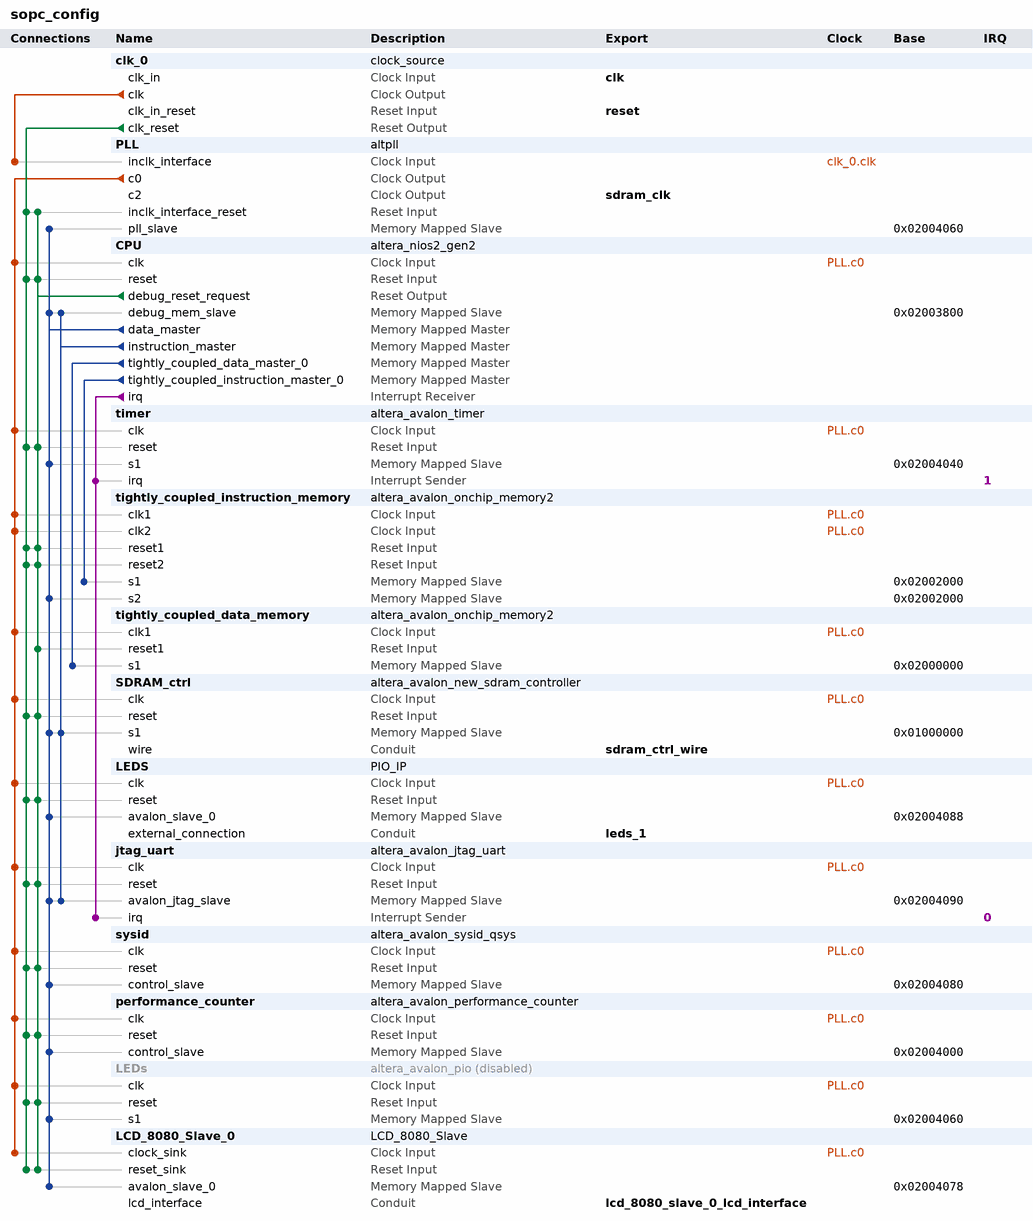
[diagram p0: system contents]
# Platform Designer (Qsys) system sopc_config, Cyclone IV E EP4CE30F23C7
# Parameters at their usual value, and those the tool derives, are not listed.
package require -exact qsys 17.0
create_system sopc_config
set_project_property DEVICE_FAMILY {Cyclone IV E}
set_project_property DEVICE EP4CE30F23C7

add_instance clk_0 clock_source 17.0
set_instance_parameter_value clk_0 clockFrequency 50000000

add_instance PLL altpll 17.0
set_instance_parameter_value PLL CLK0_DIVIDE_BY 1
set_instance_parameter_value PLL CLK0_MULTIPLY_BY 1
set_instance_parameter_value PLL CLK2_DIVIDE_BY 1
set_instance_parameter_value PLL CLK2_DUTY_CYCLE 50
set_instance_parameter_value PLL CLK2_MULTIPLY_BY 1
set_instance_parameter_value PLL CLK2_PHASE_SHIFT 0
set_instance_parameter_value PLL INCLK0_INPUT_FREQUENCY 20000
set_instance_parameter_value PLL PORT_ARESET PORT_UNUSED
set_instance_parameter_value PLL PORT_LOCKED PORT_UNUSED
set_instance_parameter_value PLL PORT_clk1 PORT_UNUSED
set_instance_parameter_value PLL PORT_clk2 PORT_USED
set_instance_parameter_value PLL PORT_clk3 PORT_UNUSED

add_instance CPU altera_nios2_gen2 17.0
set_instance_parameter_value CPU dcache_numTCDM 1
set_instance_parameter_value CPU dcache_size 2048
set_instance_parameter_value CPU exceptionSlave tightly_coupled_instruction_memory.s1
set_instance_parameter_value CPU icache_numTCIM 1
set_instance_parameter_value CPU icache_size 4096
set_instance_parameter_value CPU impl Fast
set_instance_parameter_value CPU resetSlave SDRAM_ctrl.s1

add_instance timer altera_avalon_timer 17.0
set_instance_parameter_value timer fixedPeriod true
set_instance_parameter_value timer period 10
set_instance_parameter_value timer periodUnits MSEC

add_instance tightly_coupled_instruction_memory altera_avalon_onchip_memory2 17.0
set_instance_parameter_value tightly_coupled_instruction_memory dataWidth 32
set_instance_parameter_value tightly_coupled_instruction_memory dualPort true
set_instance_parameter_value tightly_coupled_instruction_memory initMemContent true
set_instance_parameter_value tightly_coupled_instruction_memory initializationFileName onchip_mem.hex
set_instance_parameter_value tightly_coupled_instruction_memory memorySize 4096

add_instance tightly_coupled_data_memory altera_avalon_onchip_memory2 17.0
set_instance_parameter_value tightly_coupled_data_memory dataWidth 32
set_instance_parameter_value tightly_coupled_data_memory dualPort false
set_instance_parameter_value tightly_coupled_data_memory initMemContent false
set_instance_parameter_value tightly_coupled_data_memory initializationFileName onchip_mem.hex
set_instance_parameter_value tightly_coupled_data_memory memorySize 8192

add_instance SDRAM_ctrl altera_avalon_new_sdram_controller 17.0
set_instance_parameter_value SDRAM_ctrl TAC 5.5
set_instance_parameter_value SDRAM_ctrl TRCD 20.0
set_instance_parameter_value SDRAM_ctrl TRP 20.0
set_instance_parameter_value SDRAM_ctrl casLatency 3
set_instance_parameter_value SDRAM_ctrl columnWidth 9
set_instance_parameter_value SDRAM_ctrl dataWidth 16
set_instance_parameter_value SDRAM_ctrl generateSimulationModel false
set_instance_parameter_value SDRAM_ctrl model single_Micron_MT48LC4M32B2_7_chip
set_instance_parameter_value SDRAM_ctrl numberOfBanks 4
set_instance_parameter_value SDRAM_ctrl numberOfChipSelects 1
set_instance_parameter_value SDRAM_ctrl powerUpDelay 100.0
set_instance_parameter_value SDRAM_ctrl refreshPeriod 15.625
set_instance_parameter_value SDRAM_ctrl rowWidth 12

add_instance LEDS PIO_IP 1.1

add_instance jtag_uart altera_avalon_jtag_uart 17.0
set_instance_parameter_value jtag_uart simInteractiveOptions NO_INTERACTIVE_WINDOWS

add_instance sysid altera_avalon_sysid_qsys 17.0
set_instance_parameter_value sysid id 12213764

add_instance performance_counter altera_avalon_performance_counter 17.0
set_instance_parameter_value performance_counter numberOfSections 3

add_instance LEDs altera_avalon_pio 17.0
set_instance_property LEDs ENABLED false
set_instance_parameter_value LEDs direction Output
set_instance_parameter_value LEDs width 8

add_instance LCD_8080_Slave_0 LCD_8080_Slave 1.5

# connections
add_connection clk_0.clk PLL.inclk_interface clock
add_connection PLL.c0 CPU.clk clock
add_connection PLL.c0 jtag_uart.clk clock
add_connection PLL.c0 LCD_8080_Slave_0.clock_sink clock
add_connection PLL.c0 LEDs.clk clock
add_connection PLL.c0 LEDS.clk clock
add_connection PLL.c0 performance_counter.clk clock
add_connection PLL.c0 SDRAM_ctrl.clk clock
add_connection PLL.c0 sysid.clk clock
add_connection PLL.c0 tightly_coupled_data_memory.clk1 clock
add_connection PLL.c0 tightly_coupled_instruction_memory.clk1 clock
add_connection PLL.c0 tightly_coupled_instruction_memory.clk2 clock
add_connection PLL.c0 timer.clk clock
add_connection clk_0.clk_reset CPU.reset reset
add_connection clk_0.clk_reset jtag_uart.reset reset
add_connection clk_0.clk_reset LCD_8080_Slave_0.reset_sink reset
add_connection clk_0.clk_reset LEDs.reset reset
add_connection clk_0.clk_reset LEDS.reset reset
add_connection clk_0.clk_reset performance_counter.reset reset
add_connection clk_0.clk_reset PLL.inclk_interface_reset reset
add_connection clk_0.clk_reset SDRAM_ctrl.reset reset
add_connection clk_0.clk_reset sysid.reset reset
add_connection clk_0.clk_reset tightly_coupled_instruction_memory.reset1 reset
add_connection clk_0.clk_reset tightly_coupled_instruction_memory.reset2 reset
add_connection clk_0.clk_reset timer.reset reset
add_connection CPU.debug_reset_request CPU.reset reset
add_connection CPU.debug_reset_request jtag_uart.reset reset
add_connection CPU.debug_reset_request LCD_8080_Slave_0.reset_sink reset
add_connection CPU.debug_reset_request LEDs.reset reset
add_connection CPU.debug_reset_request LEDS.reset reset
add_connection CPU.debug_reset_request performance_counter.reset reset
add_connection CPU.debug_reset_request PLL.inclk_interface_reset reset
add_connection CPU.debug_reset_request SDRAM_ctrl.reset reset
add_connection CPU.debug_reset_request sysid.reset reset
add_connection CPU.debug_reset_request tightly_coupled_data_memory.reset1 reset
add_connection CPU.debug_reset_request tightly_coupled_instruction_memory.reset1 reset
add_connection CPU.debug_reset_request tightly_coupled_instruction_memory.reset2 reset
add_connection CPU.debug_reset_request timer.reset reset
add_connection CPU.data_master CPU.debug_mem_slave avalon
set_connection_parameter_value CPU.data_master/CPU.debug_mem_slave baseAddress 0x02003800
add_connection CPU.data_master jtag_uart.avalon_jtag_slave avalon
set_connection_parameter_value CPU.data_master/jtag_uart.avalon_jtag_slave baseAddress 0x02004090
add_connection CPU.data_master LCD_8080_Slave_0.avalon_slave_0 avalon
set_connection_parameter_value CPU.data_master/LCD_8080_Slave_0.avalon_slave_0 baseAddress 0x02004078
add_connection CPU.data_master LEDS.avalon_slave_0 avalon
set_connection_parameter_value CPU.data_master/LEDS.avalon_slave_0 baseAddress 0x02004088
add_connection CPU.data_master LEDs.s1 avalon
set_connection_parameter_value CPU.data_master/LEDs.s1 baseAddress 0x02004060
add_connection CPU.data_master performance_counter.control_slave avalon
set_connection_parameter_value CPU.data_master/performance_counter.control_slave baseAddress 0x02004000
add_connection CPU.data_master PLL.pll_slave avalon
set_connection_parameter_value CPU.data_master/PLL.pll_slave baseAddress 0x02004060
add_connection CPU.data_master SDRAM_ctrl.s1 avalon
set_connection_parameter_value CPU.data_master/SDRAM_ctrl.s1 baseAddress 0x01000000
add_connection CPU.data_master sysid.control_slave avalon
set_connection_parameter_value CPU.data_master/sysid.control_slave baseAddress 0x02004080
add_connection CPU.data_master tightly_coupled_instruction_memory.s2 avalon
set_connection_parameter_value CPU.data_master/tightly_coupled_instruction_memory.s2 baseAddress 0x02002000
add_connection CPU.data_master timer.s1 avalon
set_connection_parameter_value CPU.data_master/timer.s1 baseAddress 0x02004040
add_connection CPU.instruction_master CPU.debug_mem_slave avalon
set_connection_parameter_value CPU.instruction_master/CPU.debug_mem_slave baseAddress 0x02003800
add_connection CPU.instruction_master jtag_uart.avalon_jtag_slave avalon
set_connection_parameter_value CPU.instruction_master/jtag_uart.avalon_jtag_slave baseAddress 0x02004090
add_connection CPU.instruction_master SDRAM_ctrl.s1 avalon
set_connection_parameter_value CPU.instruction_master/SDRAM_ctrl.s1 baseAddress 0x01000000
add_connection CPU.tightly_coupled_data_master_0 tightly_coupled_data_memory.s1 avalon
set_connection_parameter_value CPU.tightly_coupled_data_master_0/tightly_coupled_data_memory.s1 baseAddress 0x02000000
add_connection CPU.tightly_coupled_instruction_master_0 tightly_coupled_instruction_memory.s1 avalon
set_connection_parameter_value CPU.tightly_coupled_instruction_master_0/tightly_coupled_instruction_memory.s1 baseAddress 0x02002000
add_connection CPU.irq jtag_uart.irq interrupt
set_connection_parameter_value CPU.irq/jtag_uart.irq irqNumber 0
add_connection CPU.irq timer.irq interrupt
set_connection_parameter_value CPU.irq/timer.irq irqNumber 1

# exported interfaces
add_interface clk clock sink
set_interface_property clk EXPORT_OF clk_0.clk_in
add_interface lcd_8080_slave_0_lcd_interface conduit end
set_interface_property lcd_8080_slave_0_lcd_interface EXPORT_OF LCD_8080_Slave_0.lcd_interface
add_interface leds_1 conduit end
set_interface_property leds_1 EXPORT_OF LEDS.external_connection
add_interface reset reset sink
set_interface_property reset EXPORT_OF clk_0.clk_in_reset
add_interface sdram_clk clock source
set_interface_property sdram_clk EXPORT_OF PLL.c2
add_interface sdram_ctrl_wire conduit end
set_interface_property sdram_ctrl_wire EXPORT_OF SDRAM_ctrl.wire

set_interconnect_requirement {$system} qsys_mm.clockCrossingAdapter HANDSHAKE
set_interconnect_requirement {$system} qsys_mm.enableEccProtection FALSE
set_interconnect_requirement {$system} qsys_mm.insertDefaultSlave FALSE
set_interconnect_requirement {$system} qsys_mm.maxAdditionalLatency 1

save_system sopc_config.qsys
